# Altium schematic sheet 12-UWB-Power.SchDoc
size A; SheetNumber: 12; SheetTotal: 16
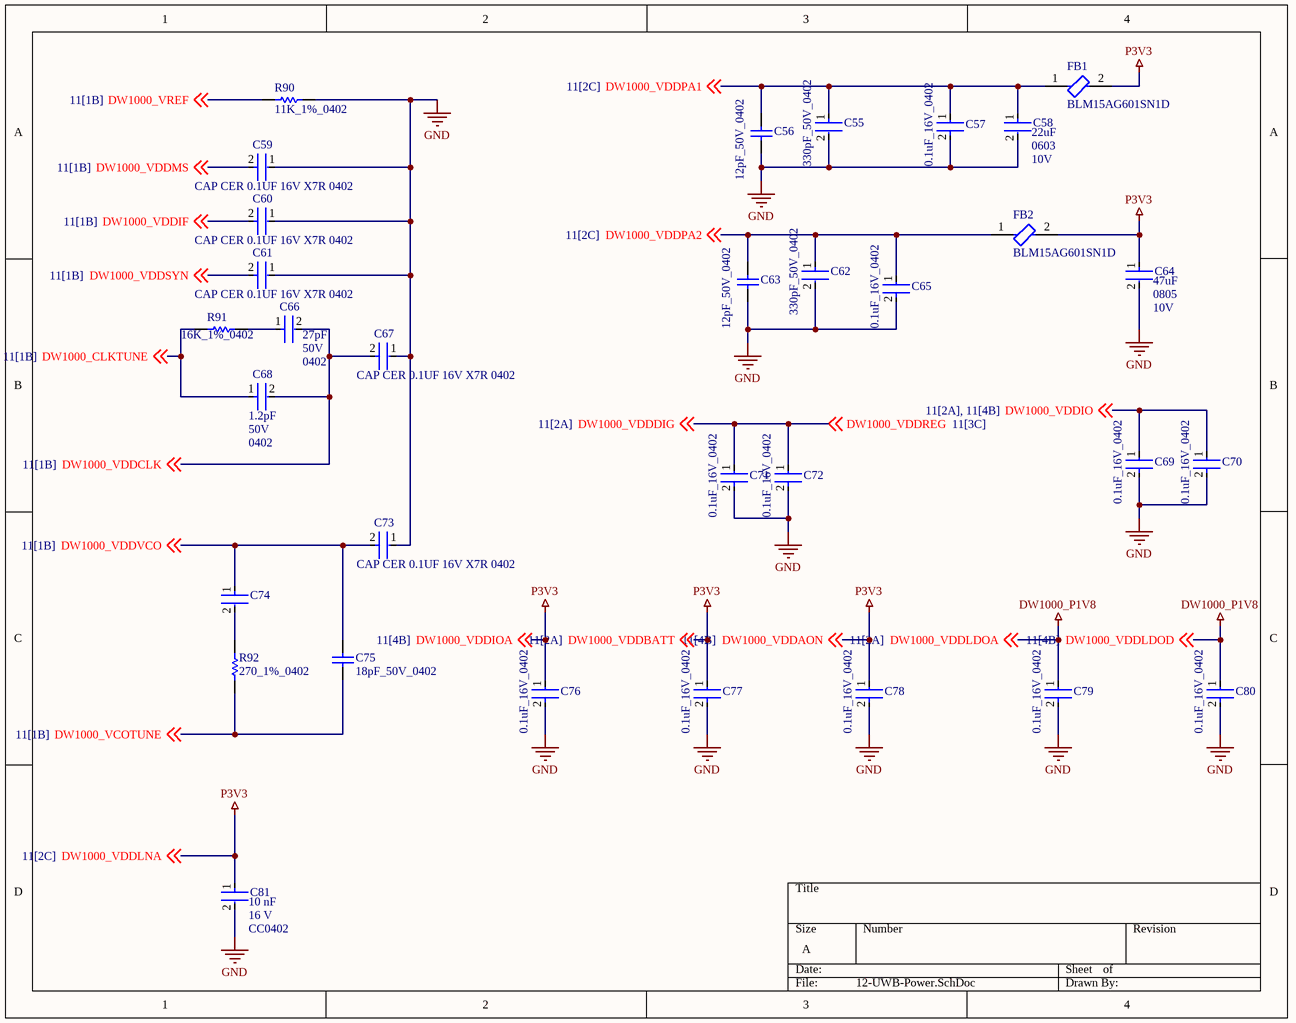
[diagram p0: 12-UWB-Power.SchDoc]

## Parts
C55  330pF_50V_0402  [FP-GRM155-0_05-MFG]
C56  12pF_50V_0402  [CAPC1005X55X25LL05T05]
C57  0.1uF_16V_0402  [FP-GRM15-MFG]
C58  Capacitance: 22uF  Voltage Rating: 10V  Case Code (Imperial): 0603  [FP-GRM188-0_2-IPC_C]  (hidden comment: GRM188R61A226ME15D)
C59  GRM155R71C104KA88D  [FP-GRM15-MFG]  (value not drawn)
C60  GRM155R71C104KA88D  [FP-GRM15-MFG]  (value not drawn)
C61  GRM155R71C104KA88D  [FP-GRM15-MFG]  (value not drawn)
C62  330pF_50V_0402  [FP-GRM155-0_05-MFG]
C63  12pF_50V_0402  [CAPC1005X55X25LL05T05]
C64  Capacitance: 47uF  Case Code (Imperial): 0805  Voltage: 10V  [FP-GRM21B-0_2-e0_2_0_7-IPC_A]  (hidden comment: GRM21BR61A476ME15L)
C65  0.1uF_16V_0402  [FP-GRM15-MFG]
C66  Voltage Rating: 50V  Case/Package: 0402  Capacitance: 27pF  [FP-0402-L_1_0_1-W_0_5_0_1-MFG]  (hidden comment: 04025A270JAT2A)
C67  GRM155R71C104KA88D  [FP-GRM15-MFG]  (value not drawn)
C68  Voltage Rating (DC): 50V  Case Code (Imperial): 0402  Capacitance: 1.2pF  [FP-GJM155-0_05-IPC_B]  (hidden comment: GJM1555C1H1R2BB01D)
C69  0.1uF_16V_0402  [FP-GRM15-MFG]
C70  0.1uF_16V_0402  [FP-GRM15-MFG]
C71  0.1uF_16V_0402  [FP-GRM15-MFG]
C72  0.1uF_16V_0402  [FP-GRM15-MFG]
C73  GRM155R71C104KA88D  [FP-GRM15-MFG]  (value not drawn)
C74  C0402C821K5RACTU  [FP-C0402-BB-MFG]  (value not drawn)
C75  18pF_50V_0402  [CAPC1005X55X25NL05T10]
C76  0.1uF_16V_0402  [FP-GRM15-MFG]
C77  0.1uF_16V_0402  [FP-GRM15-MFG]
C78  0.1uF_16V_0402  [FP-GRM15-MFG]
C79  0.1uF_16V_0402  [FP-GRM15-MFG]
C80  0.1uF_16V_0402  [FP-GRM15-MFG]
C81  value 10 nF  Package: CC0402  Voltage Rating: 16 V  [FP-CC0402-MFG]  (hidden comment: CC0402KRX7R7BB103)
FB1  BLM15AG601SN1D  [FP-BLM15-0_05-MFG]
FB2  BLM15AG601SN1D  [FP-BLM15-0_05-MFG]
R90  11K_1%_0402  [RESC1005X40X25LL05T10]
R91  16K_1%_0402  [RESC1005X40X25ML05T10]
R92  270_1%_0402  [RESC1005X40X25ML05T05]

## Nets
DW1000_P1V8: C79.1 C80.1 ; off-sheet DW1000_VDDLDOD, off-sheet DW1000_VDDLDOA  [also labelled DW1000_VDDLDOA, DW1000_VDDLDOD]
GND: C55.2 C56.1 C57.2 C58.2 C59.1 C60.1 C61.1 C62.2 C63.1 C64.2 C65.2 C67.1 C69.2 C70.2 C71.2 C72.2 C73.1 C76.2 C77.2 C78.2 C79.2 C80.2 C81.2 R90.2
P3V3: C64.1 C76.1 C77.1 C78.1 C81.1 FB1.2 FB2.2 ; off-sheet DW1000_VDDLNA, off-sheet DW1000_VDDAON, off-sheet DW1000_VDDIOA, off-sheet DW1000_VDDBATT  [also labelled DW1000_VDDAON, DW1000_VDDBATT, DW1000_VDDIOA, DW1000_VDDLNA]
DW1000_CLKTUNE: C68.1 R91.1 ; off-sheet DW1000_CLKTUNE
DW1000_VCOTUNE: C75.1 R92.1 ; off-sheet DW1000_VCOTUNE
DW1000_VDDCLK: C66.2 C67.2 C68.2 ; off-sheet DW1000_VDDCLK
DW1000_VDDDIG: C71.1 C72.1 ; off-sheet DW1000_VDDREG, off-sheet DW1000_VDDDIG  [also labelled DW1000_VDDREG]
DW1000_VDDIF: C60.2 ; off-sheet DW1000_VDDIF
DW1000_VDDIO: C69.1 C70.1 ; off-sheet DW1000_VDDIO
DW1000_VDDMS: C59.2 ; off-sheet DW1000_VDDMS
DW1000_VDDPA1: C55.1 C56.2 C57.1 C58.1 FB1.1 ; off-sheet DW1000_VDDPA1
DW1000_VDDPA2: C62.1 C63.2 C65.1 FB2.1 ; off-sheet DW1000_VDDPA2
DW1000_VDDSYN: C61.2 ; off-sheet DW1000_VDDSYN
DW1000_VDDVCO: C73.2 C74.1 C75.2 ; off-sheet DW1000_VDDVCO
DW1000_VREF: R90.1 ; off-sheet DW1000_VREF
NetC66_1: C66.1 R91.2
NetC74_2: C74.2 R92.2

## Library data of the parts
C55 C62 = CMP-06035-004830-1: Chip Multilayer Ceramic Capacitors for General Purpose, 0402, 330pF, C0G, 30ppm/°C, 5%, 50V; Insulation Resistance: 10GR; REACH SVHC: No SVHC; Depth: 0.5mm; Voltage Rating (DC): 50V; Number of Pins: 2; Max Operating Temperature: 125°C; Dielectric: C0G; Tolerance: 5%; Package Quantity: 1; Length: 1mm; Thickness: 0.022inch; Case/Package: 0402; Lead Free: Lead Free; Case Code (Imperial): 0402; Material: Ceramic; Voltage Rating: 50V; Voltage: 50V; Radiation Hardening: No; Min Operating Temperature: -55°C; Packaging: Tape and Reel; Capacitance: 330pF; Case Code (Metric): 1005; Width: 0.5mm; Mount: Surface Mount; Height: 0.5mm; Temperature Coefficient: 30ppm/°C; Termination: SMD/SMT
C56 C63 = CMP-2000-06069-1: Chip Capacitor, 12 pF, +/- 5%, 50 V, -55 to 125 degC, 0402 (1005 Metric), RoHS, Tape and Reel; Manufacturer: Yageo; Capacitance: 12pF; Voltage - Rated: 50V; Other Names: 311-1016-6311-1266-6311-1266-6-ND; Catalog Drawings: CC_0402; Featured Product: CommodityMultilayerCeramicCapacitors–CCSeries; Product Training Modules: MultilayerCeramicCapacitors; Online Catalog: CCSeries; Temperature Coefficient: C0G,NP0; Mounting Technology: SurfaceMount; Package Reference: 0402; Lead Style: -; Datasheet URL: http://www.yageo.com/NewPortal/yageodocoutput?fileName=/pdf/MLCC/UPY-GP_NP0_16V-to-50V_14.pdf; Height - Seated (Max): -; Mounting Type: SurfaceMount,MLCC; Series: CC; Standard Package: 1; Manufacturer URL: http://www.yageo.com/; Package / Case: 0402(1005Metric); Features: -; Applications: GeneralPurpose; Family: CeramicCapacitors; Size / Dimension: 0.039"Lx0.020"W(1.00mmx0.50mm); Ratings: -; Package Description: 2-Pin Surface Mount Device, Body 1 x 0.5 mm; Datasheet Version: Rev. 14, 07/2016; Lead Spacing: -; Packaging: Digi-Reel®; Category: Capacitors; Tolerance: ±5%; Thickness (Max): 0.022"(0.55mm); Operating Temperature: -55°C~125°C
C57 C65 C69-C72 C76-C80 = CMP-2100-03641-2: Manufacturer Part Number: GRM155R71C104KA88D; Manufacturer: Murata; Temperature Characteristic: X7R; Standoff Height: 0mm; Tolerance: 10%; Voltage Rating: 16Vdc; Material: Ceramic; Capacitance: 0.10μF; Value: 0.10μF; RoHS: TRUE; Octopart: https://octopart.com/grm155r71c104ka88d-murata-196880; Digikey Description: CAP CER 0.1UF 16V X7R 0402; Device Class L3: Ceramic Capacitors; Height: 0.55mm; ComponentLink2Description: Datasheet; Temperature Range Low: -55°C; Ipc Land Pattern Name: CAPC10050X219; ComponentLink2URL: https://search.murata.co.jp/Ceramy/image/img/A01X/G101/ENG/GRM155R71H471KA01-01A.pdf; Device Class L1: Passive Components; Lead Free: yes; Category: Cap; Package: GRM15; Temperature: -55°C to +125°C; Device Class L2: Capacitors; Temperature Range High: +125°C; Mouser Description: 0402 0.1 uF 16V ±10 % Tolerance X7R SMT Multilayer Ceramic Capacitor
C58 = CMP-2000-06337-3: Chip Multilayer Ceramic Capacitors for General Purpose, 0603, 22uF, X5R, 15%, 20%, 10V; Tolerance: 20%; Weight: 0.000222oz; Material: Ceramic; Depth: 0.8mm; Length: 1.6mm; Termination: SMD/SMT; Packaging: Tape and Reel; Width: 0.8mm; Mount: Surface Mount; Voltage Rating (DC): 10V; Case/Package: 0603; Thickness: 0.039inch; REACH SVHC: No SVHC; Dielectric: X5R; Height: 0.8mm; Package Quantity: 4000; Case Code (Metric): 1608; Min Operating Temperature: -55°C; Lead Free: Lead Free; Max Operating Temperature: 85°C
C59-C61 C67 C73 = CMP-2100-03641-2: CAP CER 0.1UF 16V X7R 0402; Manufacturer: Murata; Standoff Height: 0mm; Tolerance: 10%; Voltage Rating: 16Vdc; Material: Ceramic; Capacitance: 0.10μF; Value: 0.10μF; RoHS: TRUE; Manufacturer Part Number: GRM155R71C104KA88D; Temperature Characteristic: X7R; Octopart: https://octopart.com/grm155r71c104ka88d-murata-196880; Digikey Description: CAP CER 0.1UF 16V X7R 0402; Device Class L3: Ceramic Capacitors; Height: 0.55mm; ComponentLink2Description: Datasheet; Temperature Range Low: -55°C; Ipc Land Pattern Name: CAPC10050X219; ComponentLink2URL: https://search.murata.co.jp/Ceramy/image/img/A01X/G101/ENG/GRM155R71H471KA01-01A.pdf; Device Class L1: Passive Components; Lead Free: yes; Category: Cap; Package: GRM15; Temperature: -55°C to +125°C; Device Class L2: Capacitors; Temperature Range High: +125°C; Mouser Description: 0402 0.1 uF 16V ±10 % Tolerance X7R SMT Multilayer Ceramic Capacitor
C64 = CMP-2000-06341-2: Chip Multilayer Ceramic Capacitors for General Purpose, 0805, 47uF, X5R, 15%, 20%, 10V; Dissipation Factor: 0.035%; Length: 2mm; Voltage Rating: 10V; Mount: Surface Mount; Width: 0.049inch; Voltage Rating (DC): 10V; Lead Free: Lead Free; REACH SVHC: No SVHC; Termination: SMD/SMT; Case/Package: 0805; Dielectric: X5R; Packaging: Tape and Reel; Max Operating Temperature: 85°C; Tolerance: 20%; Thickness: 0.057inch; Dielectric Material: Ceramic; Min Operating Temperature: -55°C; Height: 1.25mm; Case Code (Metric): 2012; Depth: 1.25mm
C66 = CMP-2008-02622-4: General Purpose Ceramic Capacitor, 0402, 27pF, 5%, C0G, 30ppm/°C, 50V; Voltage Rating (DC): 50V; Number of Pins: 2; Lead Free: Lead Free; RoHS Compliant: Yes; Dielectric Material: Ceramic; Height: 0.5mm; Voltage: 50V; Length: 1mm; Tolerance: 5%; Case Code (Imperial): 0402; Min Operating Temperature: -55°C; Max Operating Temperature: 125°C; Termination: SMD/SMT; Depth: 0.5mm; Width: 0.02inch; Dielectric: C0G; Radiation Hardening: No; Package Quantity: 1; Packaging: Tape and Reel; REACH SVHC: No SVHC; Thickness: 0.022inch; Temperature Coefficient: 0ppm/°C; Mount: Surface Mount; Case Code (Metric): 1005; Contact Plating: Tin
C68 = CMP-2008-03813-2: Multi-Layer Ceramic Capacitor 1.2pF C0G  ±0.1pF 0402 Paper T/R; Temperature Coefficient: 30ppm/°C; Case Code (Metric): 1005; Lead Free: Lead Free; Packaging: Tape and Reel; Radiation Hardening: No; Dielectric: C0G; Weight: 2.3E-05oz; Width: 0.5mm; Case/Package: 0402; Length: 1mm; Voltage Rating: 50V; Number of Pins: 2; Depth: 0.5mm; Thickness: 0.022inch; Voltage: 50V; Package Quantity: 10000; Max Operating Temperature: 125°C; Height: 0.5mm; REACH SVHC: No SVHC; Mount: Surface Mount; Min Operating Temperature: -55°C; Termination: SMD/SMT; Lead Pitch: 0.3mm
C74 = CMP-2008-03258-2: CAP CER 820PF 50V 10% X7R 0402; Manufacturer: Kemet; Temperature Coefficient: 15%; Tolerance: 0.1; Material: Ceramic; Lead Free: Yes; ComponentLink2Description: Datasheet; Manufacturer Part Number: C0402C821K5RACTU; Device Class L1: Passive Components; Device Class L2: Capacitors; ComponentLink2URL: https://content.kemet.com/datasheets/KEM_C1002_X7R_SMD.pdf; Temperature Range High: +125°C; Device Class L3: Ceramic Capacitors; Automotive: No; Value: 820 pF; Temperature Characteristic: X7R; Temperature Range Low: -55°C; Height: 0.55mm; Package: C0402-BB; Temperature: -55°C to +125°C; Capacitance: 820 pF; Category: Cap; Ipc Land Pattern Name: CAPC10050X50; Digikey Description: CAP CER 820PF 50V 10% X7R 0402; RoHS: TRUE; Octopart: https://octopart.com/c0402c821k5ractu-kemet-10304767; Mouser Description: Multilayer Ceramic Capacitors MLCC - SMD/SMT 50volts 820pF X7R 10%; Voltage Rating: 50 V
C75 = CMP-2008-03918-1: Part Number: GRM1555C1H180JA01D; Manufacturer: Murata
C81 = CMP-03422-000501-1: CAP CER 10000PF 16V X7R 0402; Manufacturer: YAGEO; Automotive Grade: NA; Material: Ceramic; Tolerance: 0.1; Temperature Coefficient: 30ppm/°C; Temperature Range Low: -55°C; Temperature Range High: +125°C; Mouser Description: 0402 10 nF 16 V ±10 % Tolerance X7R SMT Multilayer Ceramic Capacitor; Footprint Url: http://www.yageo.com/exep/pages/download/literatures/UPY-C_GEN_24.pdf; Category: Cap; RoHS: TRUE; Capacitance: 10 nF; Manufacturer Part Number: CC0402KRX7R7BB103; ComponentLink2Description: Datasheet; Ipc Land Pattern Name: CAPC10050X50; Automotive: No; ComponentLink2URL: http://www.yageo.com/documents/recent/UPY-GP_NP0_16V-to-50V_16.pdf; Device Class L1: Passive Components; Height: 0.55mm; Temperature Characteristic: X7R; Device Class L3: Ceramic Capacitors; Lead Free: Yes; Device Class L2: Capacitors; Digikey Description: CAP CER 10000PF 16V X7R 0402; Octopart: https://octopart.com/cc0402krx7r7bb103-yageo-192895; Temperature: -55°C to +125°C
FB1 FB2 = CMP-0686-00187-4: Chip Ferrite Bead, 0402, 600Ω @ 100MHz, 0.52Ω, 25%, 300mA; DC Resistance-Max: 600mR; Number of Lines: 1; DC Resistance (DCR): 520mR; Shielding: Unshielded; Impedance: 600R; Material: Steel; Frequency: 100MHz; Lead Free: Lead Free; Max DC Current: 300mA; Test Frequency: 100MHz; Depth: 0.55mm; Length: 1mm; Case Code (Imperial): 0402; Packaging: Tape and Reel; Height: 0.5mm; Max Operating Temperature: 125°C; Military Standard: Not; REACH SVHC: No SVHC; Case Code (Metric): 1005; Series: BLM15AG_SN; Core Material: Ferrite; Termination: SMD/SMT; DC Current: 300mA; Package Quantity: 10000; Width: 0.5mm; RoHS Compliant: Yes; Min Operating Temperature: -55°C; Current Rating: 300mA; Case/Package: 0402; Number of Pins: 2; Radiation Hardening: No; Tolerance: 25%; Number of Circuits: 1; Max Current Rating: 300mA
R90 = CMP-2002-07365-1: Manufacturer: Yageo / Phycomp; Part Number: RC0402FR-0711KL
R91 = CMP-2002-07038-1: Manufacturer: Yageo / Phycomp; Part Number: RC0402FR-0716KL
R92 = CMP-2002-08427-1: Part Number: CRCW0402270RFKED; Manufacturer: Vishay Dale